# Altium schematic sheet current amplifier 01.SchDoc
size A4; Size: A4; PageSetup: Record=PageOptions?CenterHorizontal=True?CenterVertical=True?PrintScale=0.96?XCorrection=1.00?YCorrection=1.00?PrintKind=0?BorderSize=5000000?LeftOffset=0?BottomOffset=0?Orientation=2?PaperLength=1000?PaperWidth=1000?Scale=100?PaperSource=7?PrintQuality=-4?MediaType=1?DitherType=10?PaperKind=A4?PrintScaleMode=1
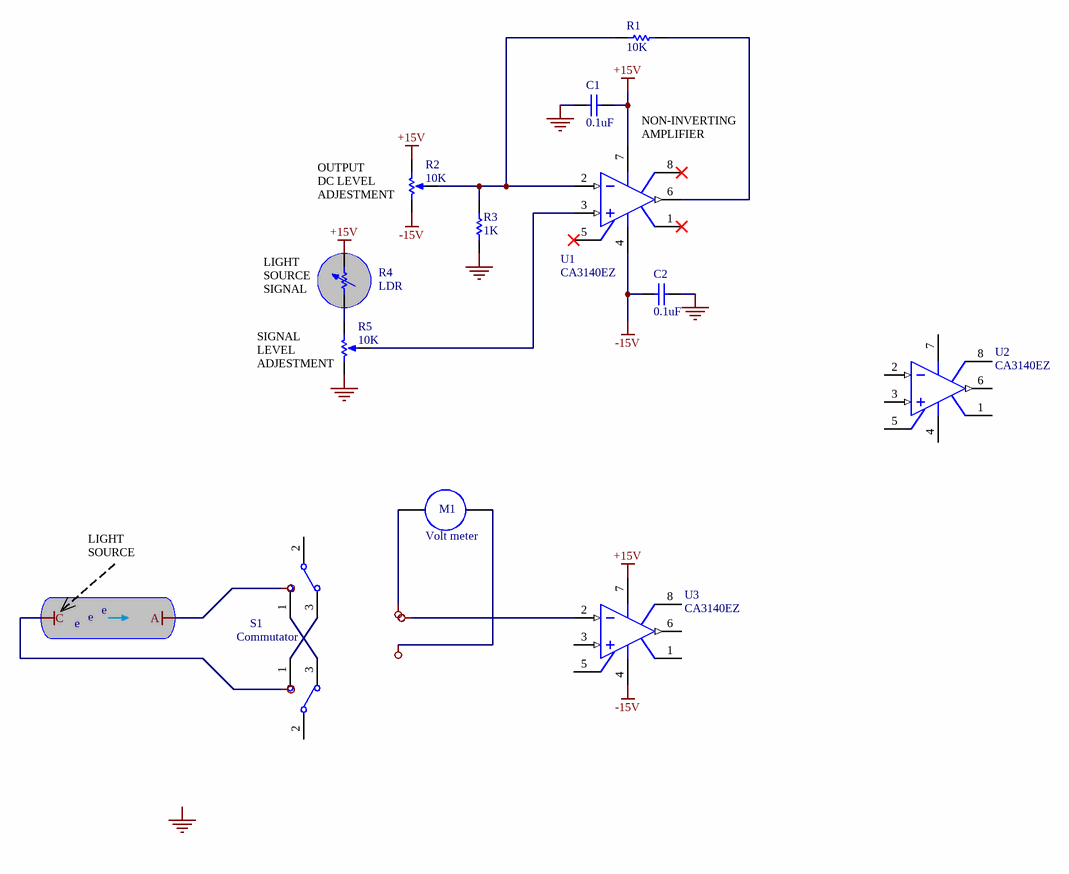
[diagram p0: current amplifier 01.SchDoc]

## Parts
C1  0.1uF  [RAD-0.3]
C2  0.1uF  [RAD-0.3]
M1  Volt meter  [RAD-0.1]
R1  10K  [AXIAL-0.3]
R2  10K  [VR5]
R3  1K  [AXIAL-0.3]
R4  LDR  [AXIAL-0.7]
R5  10K  [VR5]
S1  Commutator  [TL36WW15050]
S2  SW-SPDT  [TL36WW15050]  (value not drawn)
U1  CA3140EZ  [H-08A]
U2  CA3140EZ  [H-08A]
U3  CA3140EZ  [H-08A]

## Nets
+15V: C1.2 R2.1(TOP) R4.2 U1.7(V+) U3.7(V+)
-15V: C2.1 R2.2(BOT) U1.4(V-) U3.4(V-)
GND: C1.1 C2.2 R3.1 R5.2(BOT)
VCC: M1.1 M1.2 U3.2(IN-)
NetR1_1: R1.1 R2.3(TAP) R3.2 U1.2(IN-)
NetR1_2: R1.2 U1.6(OUT)
NetR4_1: R4.1 R5.1(TOP)
NetR5_3: R5.3(TAP) U1.3(IN+)
NetS1_1: S1.1 S2.3
NetS1_3: S1.3 S2.1

Not connected (* = marked no-connect by the designer): S1 2; S2 2; U1 1(OS_NUL)* 5(OS_NUL)* 8(TAB)*; U2 1(OS_NUL) 2(IN-) 3(IN+) 4(V-) 5(OS_NUL) 6(OUT) 7(V+) 8(TAB); U3 1(OS_NUL) 3(IN+) 5(OS_NUL) 6(OUT) 8(TAB)

## Notes on the sheet
- NON-INVERTING
  AMPLIFIER
- (near R2) OUTPUT
  DC LEVEL
  ADJESTMENT
- (near R4) LIGHT SOURCE
  SIGNAL
- (near R5) SIGNAL
  LEVEL
  ADJESTMENT
- LIGHT SOURCE
- e
- Labels drawn without touching a wire or pin: GND
- Title:
- Date:
- Draw By:
- Size:
- File:
- Approve By:

## Library data of the parts
C1 C2 = Cap: Capacitor; Published: 8-Jun-2000; LatestRevisionDate: 17-Jul-2002; LatestRevisionNote: Re-released for DXP Platform.; PackageReference: RAD-0.3; Publisher: Altium Limited; PackageDescription: Radial Cap, Thru-Hole; 2 Leads; 0.3 in Pin Spacing; Value: 0.1uF
M1 = Meter: Indicating Instrument; Note: Place a "letter" into the symbol to show the function of the meter or instrument; Published: 24-Mar-1999; LatestRevisionDate: 17-Jul-2002; LatestRevisionNote: Re-released for DXP Platform.; PackageReference: RAD-0.1; Publisher: Altium Limited; PackageDescription: Radial Cap, Thru-Hole; 2 Leads; 0.1 in Pin Spacing
R1 R3 = Res1: Resistor; Published: 8-Jun-2000; LatestRevisionDate: 17-Jul-2002; LatestRevisionNote: Re-released for DXP Platform.; PackageReference: AXIAL-0.3; Publisher: Altium Limited; PackageDescription: Axial Device, Thru-Hole; 2 Leads; 0.3 in Pin Spacing
  R1: Value: 10K
  R3: Value: 1K
R2 R5 = RPot: Potentiometer; Sim Note: Enter the Resistance value and the set point into parameter fields.; Set Position: 0.5; Published: 8-Jun-2000; LatestRevisionDate: 17-Jul-2002; LatestRevisionNote: Re-released for DXP Platform.; PackageReference: VR5; Publisher: Altium Limited; PackageDescription: Variable Resistor, Thru-Hole; 3 Leads; Value: 10K
R4 = Res Adj1: Variable Resistor; Value: 1K; Set Position: 0.5; Published: 8-Jun-2000; LatestRevisionDate: 17-Jul-2002; LatestRevisionNote: Re-released for DXP Platform.; PackageReference: AXIAL-0.7; Publisher: Altium Limited; PackageDescription: Axial Device, Thru-Hole; 2 Leads; 0.7 in Pin Spacing
S1 S2 = SW-SPDT: SPDT Subminiature Toggle Switch, Right Angle Mounting, Vertical Actuation; Published: 24-Mar-1999; LatestRevisionDate: 17-Dec-2003; LatestRevisionNote: Schematic revised, PCB Footprint replaced.; DatasheetVersion: 05-Dec-2000; PackageReference: TL36WW15050; Publisher: Altium Limited; PackageDescription: Switch; 4 Leads; ComponentLink1Description: Manufacturer Link; ComponentLink1URL: http://www.apem.com
U1-U3 = Op Amp: FET Operational Amplifier; Published: 8-Jun-2000; LatestRevisionDate: 17-Jul-2002; LatestRevisionNote: Re-released for DXP Platform.; DatasheetVersion: REV. B; PackageVersion: 1990; PackageReference: H-08A; Publisher: Altium Limited; PackageDescription: Can; 8 Leads; Pin Circle Dia. 5.08 mm; Lead Dia. 0.53 mm (max); ComponentLink1Description: Manufacturer Link; ComponentLink1URL: http://www.analog.com/